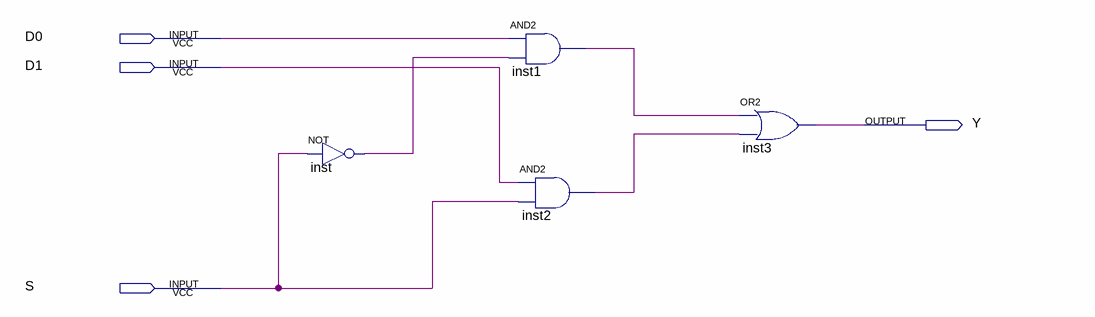
[diagram p0: schematic sheet]
// Quartus schematic Mux2to1_1bit.bdf as structural Verilog: 4 symbols, 4 pins
module Mux2to1_1bit (
  input  D0,
  input  D1,
  input  S,
  output Y
);

  wire inst1_out, inst2_out, inst_out;

  not inst (inst_out, S);
  and inst1 (inst1_out, D0, inst_out);
  and inst2 (inst2_out, D1, S);
  or inst3 (Y, inst1_out, inst2_out);
endmodule
